# Altium schematic sheet Data.SchDoc
size A3; SheetNumber: 3; SheetTotal: 3
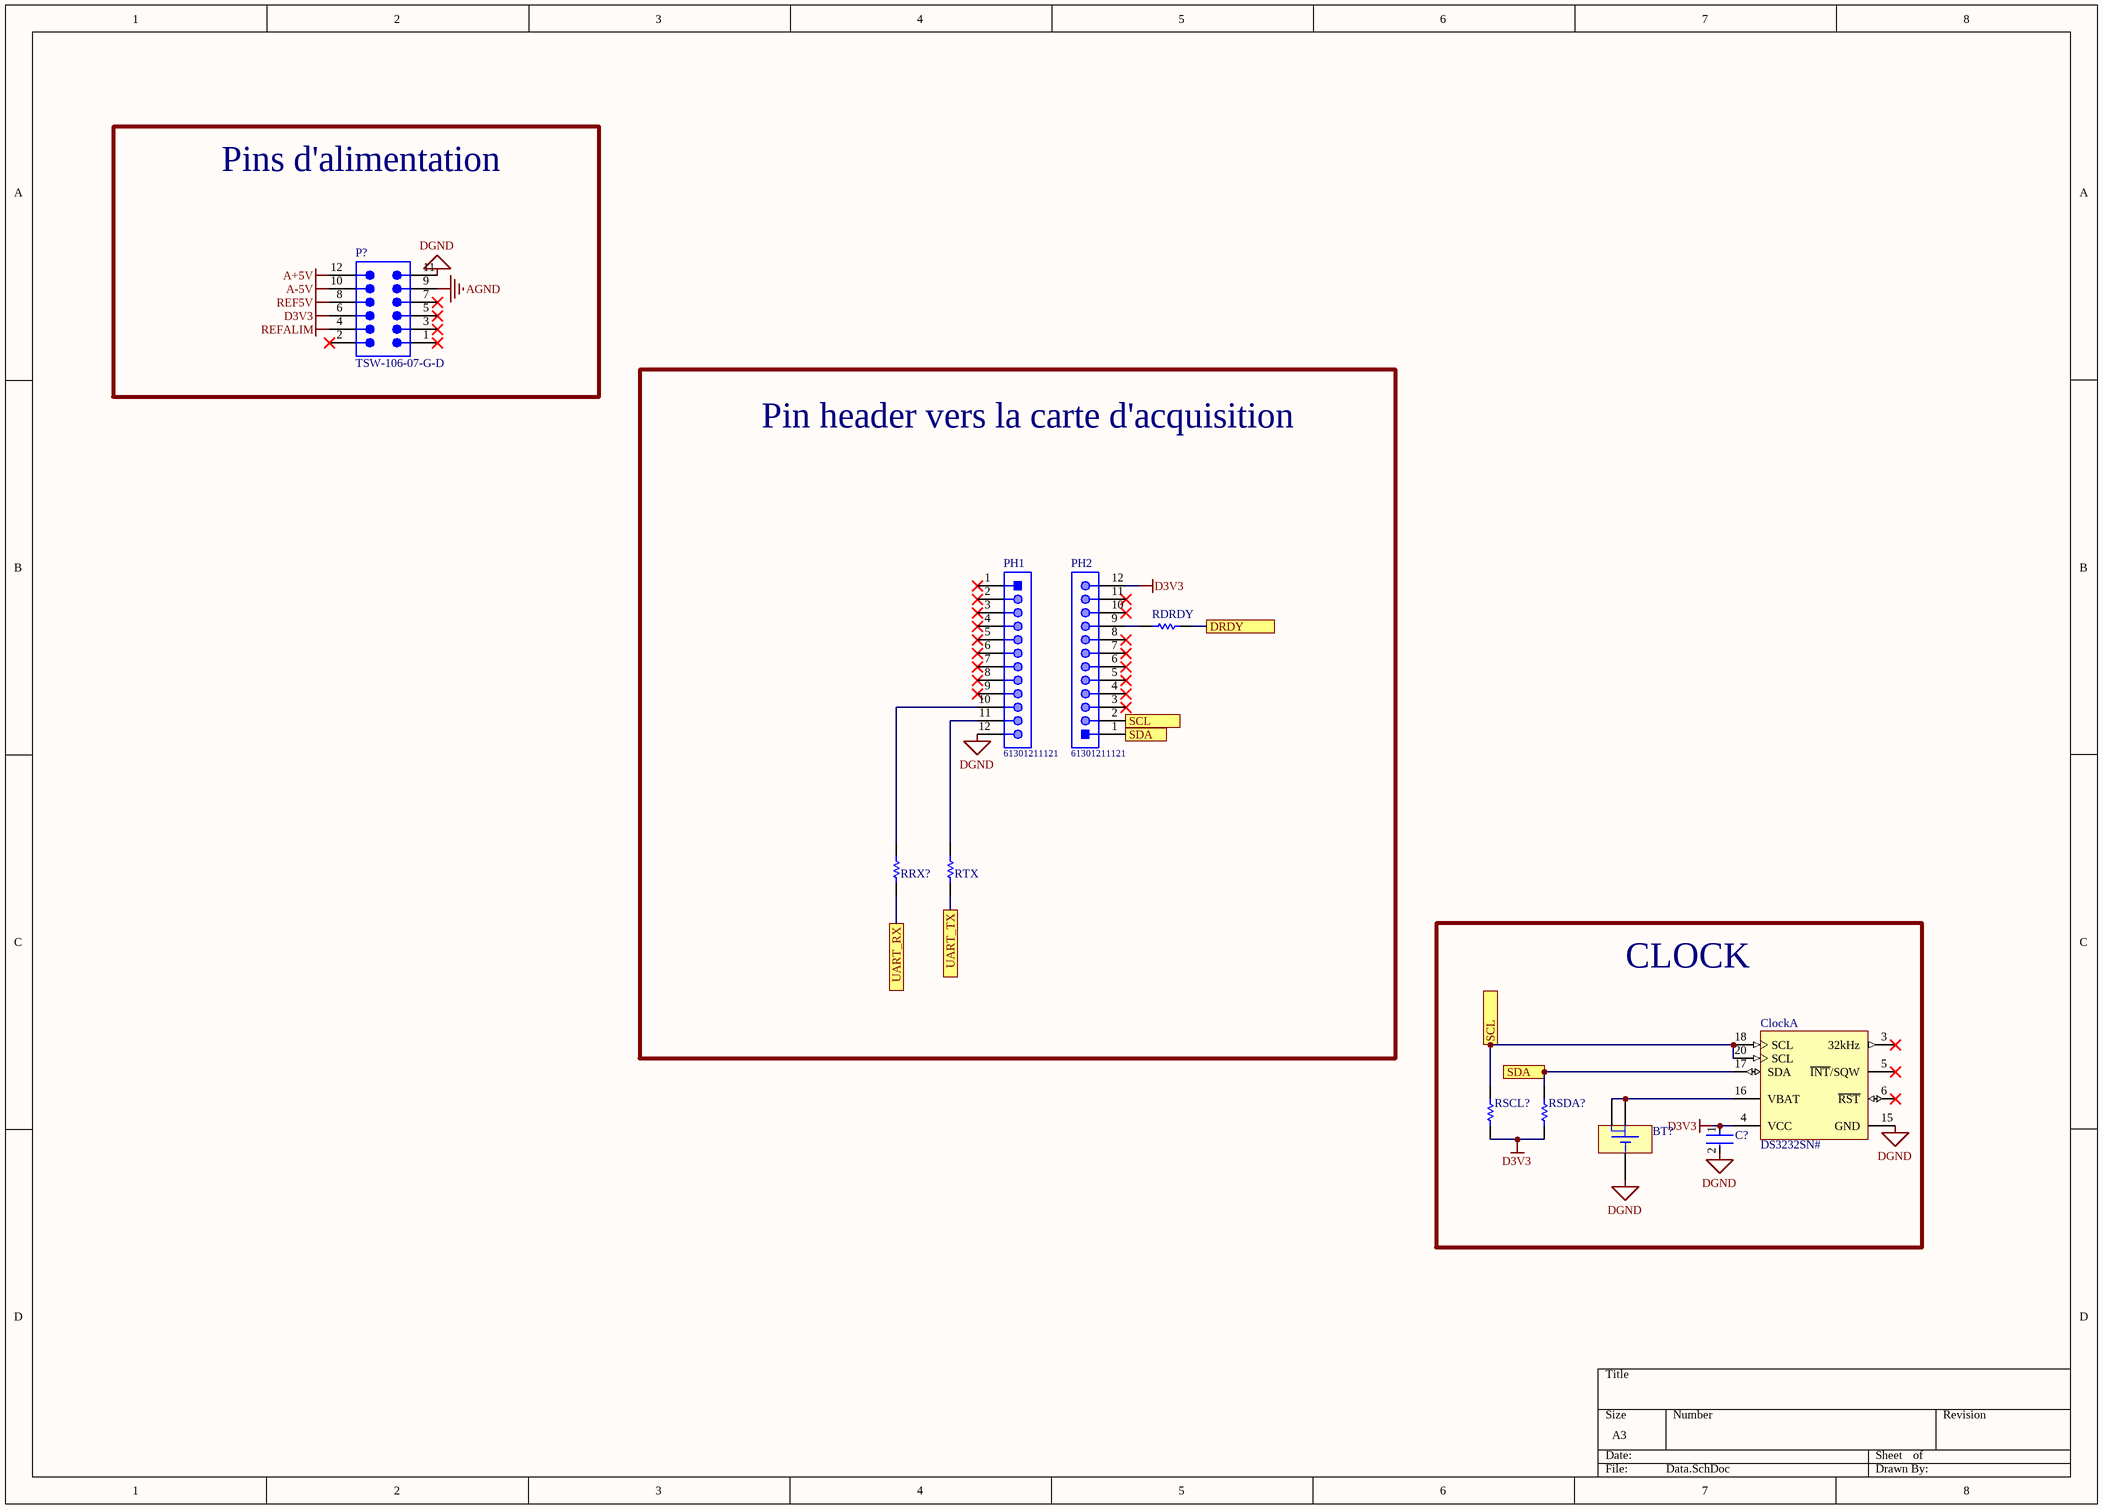
[diagram p0: Data.SchDoc]

## Parts
BT?  BAT-HLD-001  [BATHLD-001]  (value not drawn)
C?  C0805C104K5RACTU  [FP-C0805C-DN-MFG]  (value not drawn)
Clock  DS3232SN#  [W20#H2_N]  (part A of 2)
P?  TSW-106-07-G-D  [SMTC-TSW-106-07-X-D]
PH1  61301211121  [61301211121]
PH2  61301211121  [61301211121]
RDRDY  ERA6AEB473V  [RESC2013X60X40ML20T25]  (value not drawn)
RRX?  ERA6AEB473V  [RESC2013X60X40ML20T25]  (value not drawn)
RSCL?  RC0805FR-074K7L  [YAGO-RC0805_M]  (value not drawn)
RSDA?  RC0805FR-074K7L  [YAGO-RC0805_M]  (value not drawn)
RTX  ERA6AEB473V  [RESC2013X60X40ML20T25]  (value not drawn)

## Blocks framed on the sheet
Pins d'alimentation: P?
Pin header vers la carte d'acquisition: PH1 PH2 RDRDY RRX? RTX
CLOCK: BT? C? Clock RSCL? RSDA?

## Ports
DRDY, SCL, SDA, UART_RX, UART_TX

## Nets
A+5V: P?.12
A-5V: P?.10
AGND: P?.9
D3V3: C?.1 Clock.4(VCC) P?.6 PH2.12 RSCL?.1 RSDA?.1
DGND: BT?.1(-) C?.2 Clock.15(GND) P?.11 PH1.12
REF5V: P?.8
REFALIM: P?.4
DRDY: RDRDY.2 ; port DRDY
SCL: Clock.18(SCL) Clock.20(SCL) PH2.2 RSCL?.2 ; port SCL
SDA: Clock.17(SDA) PH2.1 RSDA?.2 ; port SDA
UART_RX: RRX?.2 ; port UART_RX
UART_TX: RTX.2 ; port UART_TX
NetBT?_2: BT?.2(+) BT?.3(+) Clock.16(VBAT)
NetPH1_10: PH1.10 RRX?.1
NetPH1_11: PH1.11 RTX.1
NetPH2_9: PH2.9 RDRDY.1

Not connected (* = marked no-connect by the designer): Clock 3(32kHz)* 5(~{INT}/SQW)* 6(~{RST})*; P? 1* 2* 3* 5* 7*; PH1 1* 2* 3* 4* 5* 6* 7* 8* 9*; PH2 3* 4* 5* 6* 7* 8* 10* 11*

## Library data of the parts
BT? = CMP-0168-00043-1: 20mm Coin Cell Battery Holder; PCB_Layout: Complies with manufacturer's recommendation.; DatasheetVersion: rev1.0, Dec-2007; PackageVersion: rev1.0, Dec-2007; PackageReference: BATHLD-001; PackageDescription: Low Profile SM Battery Holder, 20mm Lithium Cell, 21.1 x 15.3 x 4.2 mm Body
C? = CMP-2007-00279-2: CAP CER 0.1UF 50V X7R 0805; Manufacturer: KEMET; Value: 0.10 μF; Tolerance: 0.1; Temperature Coefficient: 30ppm/°C; Material: Ceramic; Manufacturer Part Number: C0805C104K5RACTU; Device Class L2: Capacitors; Temperature Range Low: -55°C; Voltage Rating: 50 V; Digikey Description: CAP CER 0.1UF 50V X7R 0805; Category: Cap; ComponentLink2Description: Datasheet; Octopart: https://octopart.com/c0805c104k5ractu-kemet-143926; RoHS: TRUE; ComponentLink2URL: https://content.kemet.com/datasheets/KEM_C1003_C0G_SMD.pdf; Temperature Characteristic: X7R; Temperature: -55°C to +125°C; Height: 0.88mm; Temperature Range High: +125°C; Device Class L1: Passive Components; Automotive: No; Lead Free: Yes; Ipc Land Pattern Name: CAPC200125X78; Device Class L3: Ceramic Capacitors; Mouser Description: Cap Ceramic 0.1uF 50V X7R 10% SMD 2.0 x 1.2 mm 125 C Paper T/R; Capacitance: 0.10 μF; Package: C0805C-DN
Clock = CMP-0254-00381-1: Extremely Accurate I2C-Integrated Real-Time Clock/TCXO/Crystal and SRAM, 20-Pin SO, -40 to 85 degC, RoHS Qualified; PackageDescription: 20-Pin Small-Outline IC, Wide (0.3in), 1.27 mm Pitch, SOIC (W), RoHS Qualified; Code_JEDEC: MS-013-AC; ComponentLink2URL: http://datasheets.maxim-ic.com/en/ds/DS3232.pdf; ComponentLink1URL: http://www.maxim-ic.com; PackageVersion: revD, 2010; Code_IPC: SOIC127P1030-20; ComponentLink3URL: http://pdfserv.maxim-ic.com/package_dwgs/21-0042.PDF; ComponentLink1Description: Manufacturer URL; PackageReference: W20#H2; ComponentLink2Description: Datasheet; ComponentLink3Description: Package Specification; DatasheetVersion: Rev 5, Jul-2010
P? = CMP-1024-00379-1: 0.025" SQ Post Header, Through-hole, Vertical, -55 to 125 degC, 2.54 mm Pitch, 12-Pin, Male, RoHS; Manufacturer: Samtec; Pitch: 2.54 mm; ComponentLink1URL: http://www.samtec.com; DatasheetVersion: F-214; ComponentLink3URL: http://www.samtec.com/documents/webfiles/cpdf/TSW-XXX-XX-XXX-X-XX-XXX-MKT.pdf; PackageVersion: DM, 8/1988; Mounting Technology: Through-hole; ComponentLink1Description: Manufacturer URL; Orientation: Vertical; PackageDescription: .025[0.64] SQ. Post Terminal Strip Assembly; ComponentLink2URL: http://www.samtec.com/documents/webfiles/pdf/TSW_TH.PDF; RoHS: True; ComponentLink3Description: Package Specification; ComponentLink2Description: Datasheet; PackageReference: TSW-106-07-X-D; Temperature Range: -55 to 125 degC; PartNumber: TSW-106-07-G-D
PH1 PH2 = CMP-1502-01086-1: THT Vertical Pin Header WR-PHD, Pitch 2.54 mm, Single Row, 12 pins; Manufacturer: Wurth Elektronik; Pin Number: 12; Gender: Male; Working Voltage: 250VAC; Rated Current: 3A; Withstanding Voltage: 500VAC; Pitch: 2.54mm; Contact Resistance: 20mOhm; Orientation: Vertical; Package Reference: 61301211121; Packaging: Bag; Operating Temperature: -40to105degC; Mounting Technology: THT; Part Number: 61301211121; Manufacturer URL: http://www.we-online.de; Row Number: Single; Publisher: WurthElektronik; Datasheet URL: https://katalog.we-online.de/em/datasheet/6130xx11121.pdf
RDRDY RRX? RTX = CMP-2001-00645-1: Manufacturer: Panasonic; Part Number: ERA6AEB473V
RSCL? RSDA? = CMP-1568-00001-1: General Puprose Chip Resistor, 4700 Ohm +/- 1%, 0.125 W, -55 to 155 degC, 2-Pin SMD, RoHS, Tape and Reel; Tolerance: +/- 1%; Power: 0.125 W; PackageDescription: 2-Pin Surface Mount Device, Body 2 x 1.25 mm; ComponentLink2URL: http://www.yageo.com/documents/recent/PYu-RC_Group_51_RoHS_L-3.pdf; Temperature Min: -55 degC; Packing: Tape and Reel; Mounting Technology: Surface Mount; PartNumber: RC0805FR-074K7L; ComponentLink1URL: http://www.yageo.com/NewPortal/_en/index.jsp; Resistance: 4700 Ohm; Temperature Max: 155 degC; ComponentLink2Description: Datasheet; DatasheetVersion: Rev. 3; RoHS: TRUE; ComponentLink1Description: Manufacturer URL